# EAGLE schematic nixie_drive_neo (EAGLE 9.5.0)

## Sheet 1 of 2
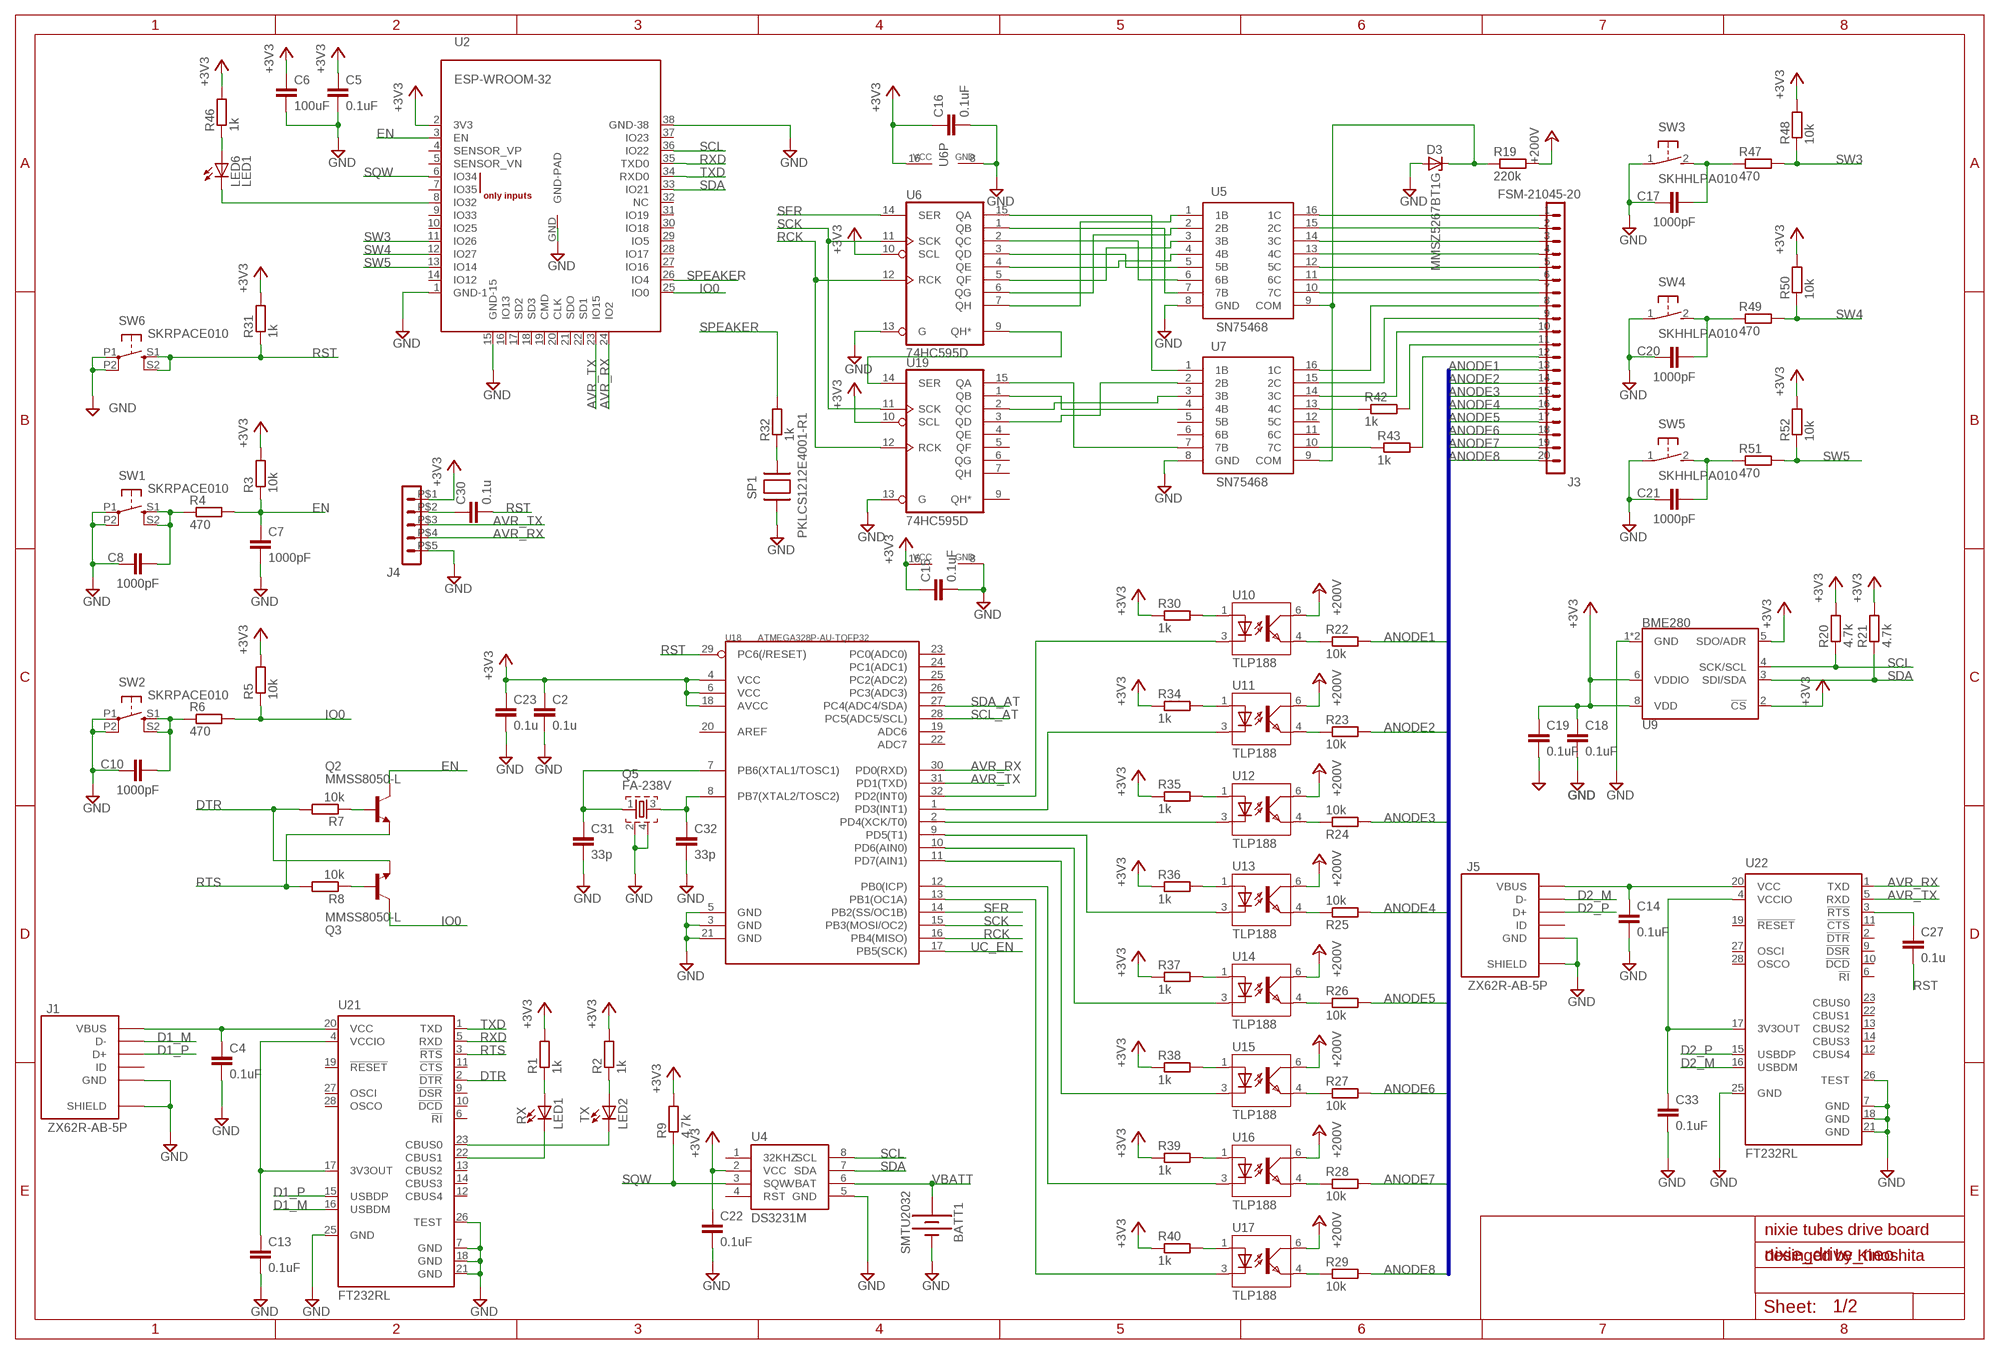
[diagram p0: schematic, sheet 1]

### Parts
BATT1  SMTU2032  [SMTU2032]
C2  0.1u  C-EUC0603  [C0603]
C4  0.1uF  C-EUC0603  [C0603]
C5  0.1uF  C-EUC0603  [C0603]
C6  100uF  C-EUC1210  [C1210]
C7  1000pF  C-EUC0603  [C0603]
C8  1000pF  C-EUC0603  [C0603]
C10  1000pF  C-EUC0603  [C0603]
C13  0.1uF  C-EUC0603  [C0603]
C14  0.1uF  C-EUC0603  [C0603]
C15  0.1uF  C-EUC0603  [C0603]
C16  0.1uF  C-EUC0603  [C0603]
C17  1000pF  C-EUC0603  [C0603]
C18  0.1uF  C-EUC0603  [C0603]
C19  0.1uF  C-EUC0603  [C0603]
C20  1000pF  C-EUC0603  [C0603]
C21  1000pF  C-EUC0603  [C0603]
C22  0.1uF  C-EUC0603  [C0603]
C23  0.1u  C-EUC0603  [C0603]
C27  0.1u  C-EUC0603  [C0603]
C30  0.1u  C-EUC0603  [C0603]
C31  33p  C-EUC0603  [C0603]
C32  33p  C-EUC0603  [C0603]
C33  0.1uF  C-EUC0603  [C0603]
D3  MMSZ5267BT1G  [SOD123]
J1  ZX62R-AB-5P  [ZX62R-B-5PA]
J3  FSM-21045-20  [FSM-21045-20]
J4  PIN_HEADER_MALE_1X05_05P  [PIN_HEADER_MALE_1X05_05P]
J5  ZX62R-AB-5P  [ZX62R-B-5PA]
LED1  RX  LEDCHIPLED_0603  [CHIPLED_0603]
LED2  TX  LEDCHIPLED_0603  [CHIPLED_0603]
LED6  LED1  LEDCHIPLED_0603  [CHIPLED_0603]
Q2  MMSS8050-L  [SOT23]
Q3  MMSS8050-L  [SOT23]
Q5  FA-238V  [FA238-V]
R1  1k  R-EU_R0603  [R0603]
R2  1k  R-EU_R0603  [R0603]
R3  10k  R-EU_R0603  [R0603]
R4  470  R-EU_R0603  [R0603]
R5  10k  R-EU_R0603  [R0603]
R6  470  R-EU_R0603  [R0603]
R7  10k  R-EU_R0603  [R0603]
R8  10k  R-EU_R0603  [R0603]
R9  4.7k  R-EU_R0603  [R0603]
R19  220k  R-EU_R0603  [R0603]
R20  4.7k  R-EU_R0603  [R0603]
R21  4.7k  R-EU_R0603  [R0603]
R22  10k  R-EU_R3216  [R3216]
R23  10k  R-EU_R3216  [R3216]
R24  10k  R-EU_R3216  [R3216]
R25  10k  R-EU_R3216  [R3216]
R26  10k  R-EU_R3216  [R3216]
R27  10k  R-EU_R3216  [R3216]
R28  10k  R-EU_R3216  [R3216]
R29  10k  R-EU_R3216  [R3216]
R30  1k  R-EU_R0603  [R0603]
R31  1k  R-EU_R0603  [R0603]
R32  1k  R-EU_R0603  [R0603]
R34  1k  R-EU_R0603  [R0603]
R35  1k  R-EU_R0603  [R0603]
R36  1k  R-EU_R0603  [R0603]
R37  1k  R-EU_R0603  [R0603]
R38  1k  R-EU_R0603  [R0603]
R39  1k  R-EU_R0603  [R0603]
R40  1k  R-EU_R0603  [R0603]
R42  1k  R-EU_R0603  [R0603]
R43  1k  R-EU_R0603  [R0603]
R46  1k  R-EU_R0603  [R0603]
R47  470  R-EU_R0603  [R0603]
R48  10k  R-EU_R0603  [R0603]
R49  470  R-EU_R0603  [R0603]
R50  10k  R-EU_R0603  [R0603]
R51  470  R-EU_R0603  [R0603]
R52  10k  R-EU_R0603  [R0603]
SP1  PKLCS1212E4001-R1  [PKLCS1212E4001-R1]
SW1  SKRPACE010  [SKRPACE010]
SW2  SKRPACE010  [SKRPACE010]
SW3  SKHHLPA010  [SKHHLPA010]
SW4  SKHHLPA010  [SKHHLPA010]
SW5  SKHHLPA010  [SKHHLPA010]
SW6  SKRPACE010  [SKRPACE010]
U2  ESP-WROOM-32  [ESP-WROOM-32]
U4  DS3231M  [SO08]
U5  SN75468  [R-PDSO-G16]
U6  74HC595D  [SO16]
U7  SN75468  [R-PDSO-G16]
U9  BME280  [LGA-8-2.5X2.5]
U10  TLP188  [11-4M1S]
U11  TLP188  [11-4M1S]
U12  TLP188  [11-4M1S]
U13  TLP188  [11-4M1S]
U14  TLP188  [11-4M1S]
U15  TLP188  [11-4M1S]
U16  TLP188  [11-4M1S]
U17  TLP188  [11-4M1S]
U18  ATMEGA328P-AU-TQFP32  MCU-ATMEGA328P-AU(TQFP32)  [TQFP32-0.8-7X7MM]
U19  74HC595D  [SO16]
U21  FT232RL  [SSOP28]
U22  FT232RL  [SSOP28]

### Nets
+3V3 [POWER]: C2.1 C5.1 C6.1 C15.1 C16.1 C18.1 C19.1 C22.1 C23.1 J4.P$1 R1.2 R2.2 R3.2 R5.2 R9.2 R20.2 R21.2 R30.1 R31.2 R34.1 R35.1 R36.1 R37.1 R38.1 R39.1 R40.1 R46.2 R48.2 R50.2 R52.2 U2.2(3V3) U4.2(VCC) U6.10(SCL) U6.16(VCC) U9.2(!CS) U9.5(SDO/ADR) U9.6(VDDIO) U9.8(VDD) U18.4(VCC) U18.6(VCC) U18.18(AVCC) U19.10(SCL) U19.16(VCC)
+200V: R19.2 U10.6(COL) U11.6(COL) U12.6(COL) U13.6(COL) U14.6(COL) U15.6(COL) U16.6(COL) U17.6(COL) ; also sheet 2
ANODE1: J3.13 R22.2
ANODE2: J3.14 R23.2
ANODE3: J3.15 R24.2
ANODE4: J3.16 R25.2
ANODE5: J3.17 R26.2
ANODE6: J3.18 R27.2
ANODE7: J3.19 R28.2
ANODE8: J3.20 R29.2
AVR_RX: J4.P$4 U2.24(IO2) U18.30(PD0(RXD)) U22.1(TXD)
AVR_TX: J4.P$3 U2.23(IO15) U18.31(PD1(TXD)) U22.5(RXD)
D1_M: J1.D- U21.16(USBDM)
D1_P: J1.D+ U21.15(USBDP)
D2_M: J5.D- U22.16(USBDM)
D2_P: J5.D+ U22.15(USBDP)
DTR: Q3.E R7.2 U21.2(!DTR)
EN: C7.1 Q2.C R3.1 R4.2 U2.3(EN)
GND: BATT1.N(-) C2.2 C4.2 C5.2 C6.2 C7.2 C8.1 C10.1 C13.2 C14.2 C15.2 C16.2 C17.1 C18.2 C19.2 C20.1 C21.1 C22.2 C23.2 C31.2 C32.2 C33.2 D3.A J1.GND J1.SHIELD@1(SHIELD) J1.SHIELD@2(SHIELD) J1.SHIELD@3(SHIELD) J1.SHIELD@4(SHIELD) J4.P$5 J5.GND J5.SHIELD@1(SHIELD) J5.SHIELD@2(SHIELD) J5.SHIELD@3(SHIELD) J5.SHIELD@4(SHIELD) Q5.2 Q5.4 SP1.2 SW1.P1(P) SW1.P2(P1) SW2.P1(P) SW2.P2(P1) SW3.1 SW4.1 SW5.1 SW6.P1(P) SW6.P2(P1) U2.1(GND-1) U2.15(GND-15) U2.38(GND-38) U2.GND(GND-PAD) U4.5(GND) U5.8(GND) U6.8(GND) U6.13(G) U7.8(GND) U9.1(GND) U9.7(GND) U18.3(GND) U18.5(GND) U18.21(GND) U19.8(GND) U19.13(G) U21.7(GND) U21.18(GND) U21.21(GND) U21.25(GND) U21.26(TEST) U22.7(GND) U22.18(GND) U22.21(GND) U22.25(GND) U22.26(TEST) ; also sheet 2
IO0: Q3.C R5.1 R6.2 U2.25(IO0)
N$1: D3.K(C) R19.1 U5.9(COM) U7.9(COM)
N$2: C27.1 U22.3(!RTS)
N$3: J3.1 U5.16(1C)
N$4: LED1.C U21.22(CBUS1)
N$5: LED2.C U21.23(CBUS0)
N$6: C8.2 R4.1 SW1.S1(S) SW1.S2(S1)
N$7: LED1.A R1.1
N$8: LED2.A R2.1
N$9: Q2.B R7.1
N$10: Q3.B R8.1
N$11: C32.1 Q5.3 U18.8(PB7(XTAL2/TOSC2))
N$12: C10.2 R6.1 SW2.S1(S) SW2.S2(S1)
N$13: C14.1 J5.VCC(VBUS) U22.20(VCC)
N$17: U6.15(QA) U7.1(1B)
N$22: U5.7(7B) U6.1(QB)
N$25: U5.6(6B) U6.2(QC)
N$26: U5.5(5B) U6.3(QD)
N$27: C31.1 Q5.1 U18.7(PB6(XTAL1/TOSC1))
N$28: R22.1 U10.4(EMIT)
N$29: R23.1 U11.4(EMIT)
N$30: R24.1 U12.4(EMIT)
N$31: R25.1 U13.4(EMIT)
N$32: R26.1 U14.4(EMIT)
N$33: R27.1 U15.4(EMIT)
N$34: R28.1 U16.4(EMIT)
N$35: R29.1 U17.4(EMIT)
N$36: R30.2 U10.1(A)
N$37: R32.1 SP1.1
N$38: U10.3(C) U18.32(PD2(INT0))
N$40: U5.4(4B) U6.4(QE)
N$41: U5.3(3B) U6.5(QF)
N$42: U5.2(2B) U6.6(QG)
N$43: U5.1(1B) U6.7(QH)
N$44: U6.9(QH*) U19.14(SER)
N$45: U7.7(7B) U19.15(QA)
N$46: U7.4(4B) U19.1(QB)
N$47: U7.3(3B) U19.2(QC)
N$48: U7.2(2B) U19.3(QD)
N$50: LED6.C U2.8(IO32)
N$51: R34.2 U11.1(A)
N$52: R35.2 U12.1(A)
N$53: R36.2 U13.1(A)
N$54: R37.2 U14.1(A)
N$55: R38.2 U15.1(A)
N$56: R39.2 U16.1(A)
N$57: R40.2 U17.1(A)
N$58: U11.3(C) U18.1(PD3(INT1))
N$59: U12.3(C) U18.2(PD4(XCK/T0))
N$60: U13.3(C) U18.9(PD5(T1))
N$61: U14.3(C) U18.10(PD6(AIN0))
N$62: U15.3(C) U18.11(PD7(AIN1))
N$63: U16.3(C) U18.12(PB0(ICP))
N$64: U17.3(C) U18.13(PB1(OC1A))
N$65: J3.2 U5.15(2C)
N$66: J3.3 U5.14(3C)
N$67: J3.4 U5.13(4C)
N$68: J3.5 U5.12(5C)
N$69: J3.6 U5.11(6C)
N$70: J3.7 U5.10(7C)
N$71: J3.8 U7.16(1C)
N$72: J3.9 U7.15(2C)
N$73: J3.10 U7.14(3C)
N$74: J3.11 R42.2
N$75: J3.12 R43.2
N$77: C30.1 J4.P$2
N$78: C33.1 U22.4(VCCIO) U22.17(3V3OUT)
N$79: R42.1 U7.13(4C)
N$80: R43.1 U7.10(7C)
N$84: C13.1 U21.4(VCCIO) U21.17(3V3OUT)
N$85: C4.1 J1.VCC(VBUS) U21.20(VCC)
N$86: C20.2 R49.1 SW4.2
N$87: C17.2 R47.1 SW3.2
N$90: C21.2 R51.1 SW5.2
N$94: LED6.A R46.1
RCK: U6.12(RCK) U18.16(PB4(MISO)) U19.12(RCK)
RST: C27.2 C30.2 R31.1 SW6.S1(S) SW6.S2(S1) U18.29(PC6(/RESET))
RTS: Q2.E R8.2 U21.3(!RTS)
RXD: U2.35(TXD0) U21.5(RXD)
SCK: U6.11(SCK) U18.15(PB3(MOSI/OC2)) U19.11(SCK)
SCL: R20.1 U2.36(IO22) U4.8(SCL) U9.4(SCK/SCL)
SCL_AT: U18.28(PC5(ADC5/SCL))
SDA: R21.1 U2.33(IO21) U4.7(SDA) U9.3(SDI/SDA)
SDA_AT: U18.27(PC4(ADC4/SDA))
SER: U6.14(SER) U18.14(PB2(SS/OC1B))
SPEAKER: R32.2 U2.26(IO4)
SQW: R9.1 U2.6(IO34) U4.3(SQW)
SW3: R47.2 R48.1 U2.11(IO26)
SW4: R49.2 R50.1 U2.12(IO27)
SW5: R51.2 R52.1 U2.13(IO14)
TXD: U2.34(RXD0) U21.1(TXD)
UC_EN: U18.17(PB5(SCK)) ; also sheet 2
VBATT: BATT1.P(+) U4.6(VBAT)
Unconnected: J1.ID J5.ID U2.4(SENSOR_VP) U2.5(SENSOR_VN) U2.7(IO35) U2.9(IO33) U2.10(IO25) U2.14(IO12) U2.16(IO13) U2.17(SD2) U2.18(SD3) U2.19(CMD) U2.20(CLK) U2.21(SDO) U2.22(SD1) U2.27(IO16) U2.28(IO17) U2.29(IO5) U2.30(IO18) U2.31(IO19) U2.32(NC) U2.37(IO23) U4.1(32KHZ) U4.4(RST) U7.5(5B) U7.6(6B) U7.11(6C) U7.12(5C) U18.19(ADC6) U18.20(AREF) U18.22(ADC7) U18.23(PC0(ADC0)) U18.24(PC1(ADC1)) U18.25(PC2(ADC2)) U18.26(PC3(ADC3)) U19.4(QE) U19.5(QF) U19.6(QG) U19.7(QH) U19.9(QH*) U21.6(!RI) U21.9(!DSR) U21.10(!DCD) U21.11(!CTS) U21.12(CBUS4) U21.13(CBUS2) U21.14(CBUS3) U21.19(!RESET) U21.27(OSCI) U21.28(OSCO) U22.2(!DTR) U22.6(!RI) U22.9(!DSR) U22.10(!DCD) U22.11(!CTS) U22.12(CBUS4) U22.13(CBUS2) U22.14(CBUS3) U22.19(!RESET) U22.22(CBUS1) U22.23(CBUS0) U22.27(OSCI) U22.28(OSCO)

### Buses
ANODE[1..8]

### Notes on the sheet
- nixie tubes drive board
- desinged by Kinoshita

## Sheet 2 of 2
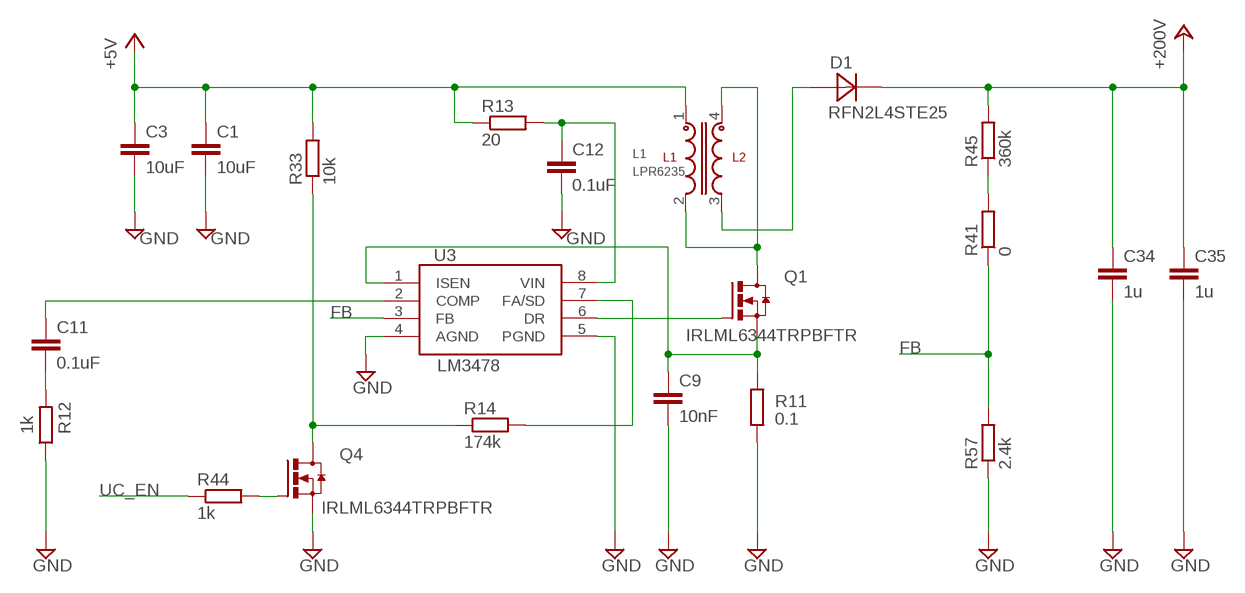
[diagram p1: schematic, sheet 2]

### Parts
C1  10uF  C-EUC0603  [C0603]
C3  10uF  C-EUC0603  [C0603]
C9  10nF  C-EUC0603  [C0603]
C11  0.1uF  C-EUC0603  [C0603]
C12  0.1uF  C-EUC0603  [C0603]
C34  1u  C-EU  [C5750]
C35  1u  C-EU  [C5750]
D1  RFN2L4STE25  [SOD-106]
L1  LPR6235  [LPR6235]
Q1  IRLML6344TRPBFTR  [SOT23-N-MOSFET]
Q4  IRLML6344TRPBFTR  [SOT23-N-MOSFET]
R11  0.1  R-EU_R0603  [R0603]
R12  1k  R-EU_R0603  [R0603]
R13  20  R-EU_R0603  [R0603]
R14  174k  R-EU_R0603  [R0603]
R33  10k  R-EU_R0603  [R0603]
R41  0  R-EU_R0603  [R0603]
R44  1k  R-EU_R0603  [R0603]
R45  360k  R-EU_R0603  [R0603]
R57  2.4k  R-EU_R0603  [R0603]
U3  LM3478  [SOIC8-LT]

### Nets
+5V: C1.1 C3.1 L1.1 R13.1 R33.2
+200V: C34.1 C35.1 D1.K(C) R45.2 ; also sheet 1
FB: R41.1 R57.2 U3.3(FB)
GND: C1.2 C3.2 C9.2 C12.2 C34.2 C35.2 Q4.S R11.1 R12.1 R57.1 U3.4(AGND) U3.5(PGND) ; also sheet 1
N$14: L1.2 L1.4 Q1.D
N$15: C11.1 U3.2(COMP)
N$16: R14.2 U3.7(FA/SD)
N$18: D1.A L1.3
N$19: Q1.G U3.6(DR)
N$20: C9.1 Q1.S R11.2 U3.1(ISEN)
N$21: C11.2 R12.2
N$23: C12.1 R13.2 U3.8(VIN)
N$24: Q4.D R14.1 R33.1
N$39: Q4.G R44.2
N$76: R41.2 R45.1
UC_EN: R44.1 ; also sheet 1

## Library data of the parts
BATT1 = taki-library:SMTU2032
C1-C23 C27 C30-C35 = taki-library:C-EU: CAPACITOR, European symbol
D1 = taki-library:RFN2L4STE25
D3 = taki-library:MMSZ5267BT1G
J1 J5 = taki-library:ZX62
J3 = taki-library:FSM-21045-20
J4 = taki-library:PIN_HEADER_MALE_1X05_05P
L1 = taki-library:LPR6235
LED1 LED2 LED6 = taki-library:LED: LED OSRAM: - CHIPLED LG R971, LG N971, LY N971, LG Q971, LY Q971, LO R971, LY R971 LH N974, LH R974 LS Q976, LO Q976, LY Q976 LO Q996 - Hyper CHIPLED LW Q18S LB Q993, LB Q99A, LB R99A - SideLED LS A670, LO A670, LY A670, LG A670, LP A670 LB A673, LV A673, LT A673, LW A673 LH A674 LY A675 LS A676, LA A676, LO A676, LY A676, LW A676 LS A679, LY A679, LG A679 - Hyper Micro SIDELED® LS Y876, LA Y876, LO Y876, LY Y876 LT Y87S - SmartLED LW L88C, LW L88S LB L89C, LB L89S, LG L890 LS L89K, LO L89K, LY L89K LS L896, LA L896, LO L896, LY L896 - TOPLED LS T670, LO T670, LY T670, LG T670, LP T670 LSG T670, LSP T670, LSY T670, LOP T670, LYG T670 LG T671, LOG T671, LSG T671 LB T673, LV T673, LT T673, LW T673 LH T674 LS T676, LA T676, LO T676, LY T676, LB T676, LH T676, LSB T676, LW T676 LB T67C, LV T67C, LT T67C, LS T67K, LO T67K, LY T67K, LW E67C LS E67B, LA E67B, LO E67B, LY E67B, LB E67C, LV E67C, LT E67C LW T67C LS T679, LY T679, LG T679 LS T770, LO T770, LY T770, LG T770, LP T770 LB T773, LV T773, LT T773, LW T773 LH T774 LS E675, LA E675, LY E675, LS T675 LS T776, LA T776, LO T776, LY T776, LB T776 LHGB T686 LT T68C, LB T68C - Hyper Mini TOPLED® LB M676 - Mini TOPLED Santana® LG M470 LS M47K, LO M47K, LY M47K Source: http://www.osram.convergy.de LUXEON: - LUMILED® LXK2-PW12-R00, LXK2-PW12-S00, LXK2-PW14-U00, LXK2-PW14-V00 LXK2-PM12-R00, LXK2-PM12-S00, LXK2-PM14-U00 LXK2-PE12-Q00, LXK2-PE12-R00, LXK2-PE12-S00, LXK2-PE14-T00, LXK2-PE14-U00 LXK2-PB12-K00, LXK2-PB12-L00, LXK2-PB12-M00, LXK2-PB14-N00, LXK2-PB14-P00, LXK2-PB14-Q00 LXK2-PR12-L00, LXK2-PR12-M00, LXK2-PR14-Q00, LXK2-PR14-R00 LXK2-PD12-Q00, LXK2-PD12-R00, LXK2-PD12-S00 LXK2-PH12-R00, LXK2-PH12-S00 LXK2-PL12-P00, LXK2-PL12-Q00, LXK2-PL12-R00 Source: www.luxeon.com KINGBRIGHT: KA-3528ASYC Source: www.kingbright.com
Q1 Q4 = taki-library:IRLML6344TRPBFTR
Q2 Q3 = taki-library:MMSS8050: Bipolar (BJT) Transistor NPN 25V 1.5A 100MHz 625mW Surface Mount SOT-23; DIGIKEY_URL: https://www.digikey.jp/product-detail/ja/micro-commercial-co/MMSS8050-L-TP/MMSS8050-L-TPMSCT-ND/2827203; MARUTSU_URL: https://www.marutsu.co.jp/pc/i/15861860/; STORE: MARUTSU; URL: https://www.marutsu.co.jp/pc/i/15861860/
Q5 = taki-library:FA-238V
R1-R9 R11-R14 R19-R29 R31-R33 R41 R44-R52 R57 = taki-library:R-EU_: RESISTOR, European symbol
R30 R34-R40 R42 R43 = 180118 Library by matsu:R-EU_: RESISTOR, European symbol
SP1 = taki-library:PKLCS1212E4001-R1
SW1 SW2 SW6 = taki-library:SKRPACE010
SW3-SW5 = taki-library:SKHHLPA010
U2 = taki-library:ESP-WROOM-32
U3 = taki-library:LM3478
U4 = taki-library:DS3231M: DS3231M Real Time Clock Accuracy +/-5ppm. Battery Backup. 2.3V to 5.5V. Datasheet <https://cdn.sparkfun.com/datasheets/Dev/Beagle/DS3231M.pdf> SparkFun Products CryptoCape <https://www.sparkfun.com/products/12773> (DEV-12773) SparkFun CryptoShield <https://www.sparkfun.com/products/13183> (DEV-13183); PROD_ID: IC-11985
U5 U7 = taki-library:SN75468
U6 U19 = taki-library:74*595: 8-bit SHIFT REGISTER, output latch
U9 = taki-library:BME280: Bosch BME280 – Combined Humidity and Pressure Sensor The BME280 is as combined digital humidity, pressure and temperature sensor based on proven sensing principles. The sensor module is housed in an extremely compact metal-lid LGA package with a footprint of only 2.5×2.5mm² with a height of 0.93mm. Its small dimensions and its low power consumption allow the implementation in battery driven devices such as handsets, GPS modules or watches. Datasheet <https://cdn.sparkfun.com/assets/learn_tutorials/4/1/9/BST-BME280_DS001-10.pdf> SparkFun Products SparkFun Atmospheric Sensor Breakout - BME280 <https://www.sparkfun.com/products/13676> (SEN-13676); PROD_ID: IC-13090
U10-U17 = taki-library:TLP188
U18 = taki-library:MCU-ATMEGA328P-AU(TQFP32): 310010049; MPN: ATMEGA328P-AU
U21 U22 = taki-library:FT232R: Source: http://www.ftdichip.com/Documents/DataSheets/DS_FT232R_v104.pdf; MPN: FT232RL; OC_FARNELL: 1146032; OC_NEWARK: 91K9918

## Net classes
0 default: width 0.152 mm
1 POWER: width 0.152 mm
2 diffrencial pair: width 0.15 mm, clearance 0.3 mm to class 0, clearance 0.3 mm to class 1, clearance 0.15 mm
3 3pin digital: width 0.15 mm
4 high-voltage: width 0.3 mm, clearance 0.7 mm to class 0, clearance 0.7 mm to class 1, clearance 0.7 mm to class 2, clearance 0.7 mm to class 3, clearance 0.7 mm